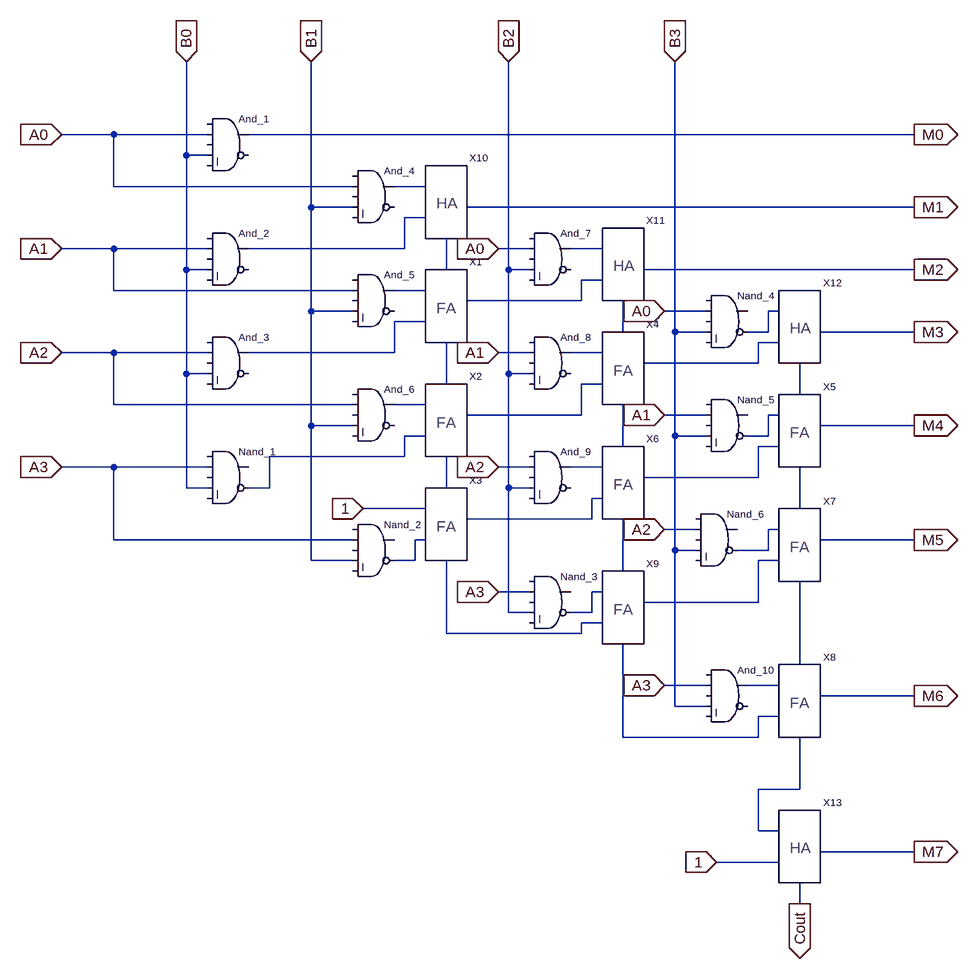
[diagram p0: schematic Bough_Wooley_Multiplier.asc]
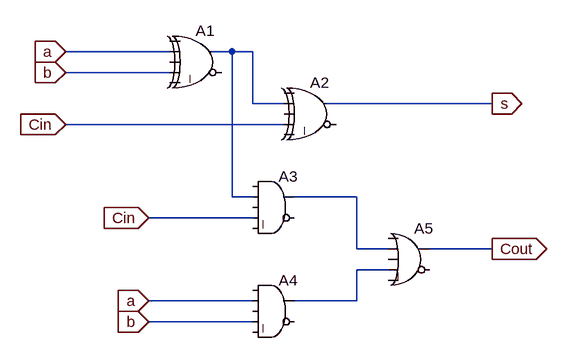
[diagram p1: sub-circuit full_adder_vertical.asc]
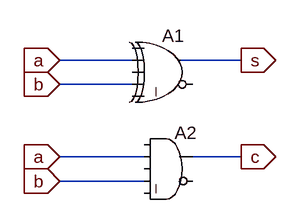
[diagram p2: sub-circuit half_adder.asc]
Bough_Wooley_Multiplier.asc, the LTspice schematic file:
Version 4
SHEET 1 3160 1104
WIRE 544 -336 464 -336
WIRE 688 -336 544 -336
WIRE 1776 -336 752 -336
WIRE 656 -304 656 -448
WIRE 688 -304 656 -304
WIRE 544 -256 544 -336
WIRE 912 -256 544 -256
WIRE 1024 -256 976 -256
WIRE 848 -224 848 -448
WIRE 912 -224 848 -224
WIRE 1776 -224 1088 -224
WIRE 1024 -208 992 -208
WIRE 544 -160 464 -160
WIRE 688 -160 544 -160
WIRE 992 -160 992 -208
WIRE 992 -160 752 -160
WIRE 1184 -160 1136 -160
WIRE 1296 -160 1248 -160
WIRE 656 -128 656 -304
WIRE 688 -128 656 -128
WIRE 1056 -128 1056 -176
WIRE 1152 -128 1152 -448
WIRE 1184 -128 1152 -128
WIRE 1776 -128 1360 -128
WIRE 1296 -112 1264 -112
WIRE 544 -96 544 -160
WIRE 912 -96 544 -96
WIRE 1024 -96 976 -96
WIRE 1264 -80 1264 -112
WIRE 1264 -80 1088 -80
WIRE 848 -64 848 -224
WIRE 912 -64 848 -64
WIRE 1456 -64 1392 -64
WIRE 1568 -64 1552 -64
WIRE 1024 -48 976 -48
WIRE 1328 -32 1328 -80
WIRE 1408 -32 1408 -448
WIRE 1456 -32 1408 -32
WIRE 1552 -32 1552 -64
WIRE 1552 -32 1520 -32
WIRE 1776 -32 1632 -32
WIRE 1568 -16 1536 -16
WIRE 544 0 464 0
WIRE 688 0 544 0
WIRE 976 0 976 -48
WIRE 976 0 752 0
WIRE 1184 0 1136 0
WIRE 1296 0 1248 0
WIRE 1536 16 1536 -16
WIRE 1536 16 1360 16
WIRE 656 32 656 -128
WIRE 688 32 656 32
WIRE 1152 32 1152 -128
WIRE 1184 32 1152 32
WIRE 1056 48 1056 -16
WIRE 1296 48 1264 48
WIRE 1600 64 1600 16
WIRE 544 80 544 0
WIRE 912 80 544 80
WIRE 1024 80 976 80
WIRE 1264 96 1264 48
WIRE 1264 96 1088 96
WIRE 1456 96 1392 96
WIRE 1568 96 1552 96
WIRE 848 112 848 -64
WIRE 912 112 848 112
WIRE 1776 112 1632 112
WIRE 1024 128 992 128
WIRE 1408 128 1408 -32
WIRE 1456 128 1408 128
WIRE 1552 128 1552 96
WIRE 1552 128 1520 128
WIRE 1328 144 1328 80
WIRE 1568 144 1536 144
WIRE 992 160 992 128
WIRE 992 160 784 160
WIRE 544 176 464 176
WIRE 688 176 544 176
WIRE 1184 176 1136 176
WIRE 1296 176 1248 176
WIRE 1536 192 1536 144
WIRE 1536 192 1360 192
WIRE 656 208 656 32
WIRE 688 208 656 208
WIRE 784 208 784 160
WIRE 784 208 752 208
WIRE 1056 208 1056 160
WIRE 1152 208 1152 32
WIRE 1184 208 1152 208
WIRE 1296 224 1280 224
WIRE 1024 240 928 240
WIRE 1600 240 1600 176
WIRE 1280 256 1280 224
WIRE 1280 256 1088 256
WIRE 1440 272 1392 272
WIRE 1568 272 1552 272
WIRE 544 288 544 176
WIRE 912 288 544 288
WIRE 1024 288 1008 288
WIRE 1776 288 1632 288
WIRE 1408 304 1408 128
WIRE 1440 304 1408 304
WIRE 1552 304 1552 272
WIRE 1552 304 1504 304
WIRE 848 320 848 112
WIRE 912 320 848 320
WIRE 1008 320 1008 288
WIRE 1008 320 976 320
WIRE 1568 320 1536 320
WIRE 1328 336 1328 256
WIRE 1184 368 1136 368
WIRE 1296 368 1280 368
WIRE 1536 384 1536 320
WIRE 1536 384 1360 384
WIRE 1152 400 1152 208
WIRE 1184 400 1152 400
WIRE 1280 400 1280 368
WIRE 1280 400 1248 400
WIRE 1296 416 1264 416
WIRE 1056 432 1056 320
WIRE 1264 432 1264 416
WIRE 1264 432 1056 432
WIRE 1600 480 1600 352
WIRE 1456 512 1392 512
WIRE 1568 512 1520 512
WIRE 1776 528 1632 528
WIRE 1408 544 1408 304
WIRE 1456 544 1408 544
WIRE 1568 560 1536 560
WIRE 1328 592 1328 448
WIRE 1536 592 1536 560
WIRE 1536 592 1328 592
WIRE 1600 672 1600 592
WIRE 1600 672 1536 672
WIRE 1536 736 1536 672
WIRE 1568 736 1536 736
WIRE 1776 768 1632 768
WIRE 1568 784 1472 784
WIRE 1600 848 1600 816
FLAG 464 -336 A0
IOPIN 464 -336 In
FLAG 464 -160 A1
IOPIN 464 -160 In
FLAG 464 0 A2
IOPIN 464 0 In
FLAG 464 176 A3
IOPIN 464 176 In
FLAG 1136 -160 A0
IOPIN 1136 -160 In
FLAG 1136 0 A1
IOPIN 1136 0 In
FLAG 1136 176 A2
IOPIN 1136 176 In
FLAG 1136 368 A3
IOPIN 1136 368 In
FLAG 1392 -64 A0
IOPIN 1392 -64 In
FLAG 1392 96 A1
IOPIN 1392 96 In
FLAG 1392 272 A2
IOPIN 1392 272 In
FLAG 1392 512 A3
IOPIN 1392 512 In
FLAG 1408 -448 B3
IOPIN 1408 -448 In
FLAG 1152 -448 B2
IOPIN 1152 -448 In
FLAG 848 -448 B1
IOPIN 848 -448 In
FLAG 656 -448 B0
IOPIN 656 -448 In
FLAG 1776 -336 M0
IOPIN 1776 -336 Out
FLAG 1776 -224 M1
IOPIN 1776 -224 Out
FLAG 1776 -128 M2
IOPIN 1776 -128 Out
FLAG 1776 -32 M3
IOPIN 1776 -32 Out
FLAG 1776 112 M4
IOPIN 1776 112 Out
FLAG 1776 288 M5
IOPIN 1776 288 Out
FLAG 1776 528 M6
IOPIN 1776 528 Out
FLAG 1776 768 M7
IOPIN 1776 768 Out
FLAG 928 240 1
IOPIN 928 240 In
FLAG 1472 784 1
IOPIN 1472 784 In
FLAG 1600 848 Cout
IOPIN 1600 848 Out
SYMBOL Digital\\and 720 -384 R0
WINDOW 0 16 24 Left 1
SYMATTR InstName And_1
SYMBOL Digital\\and 720 -208 R0
WINDOW 0 16 24 Left 1
SYMATTR InstName And_2
SYMBOL Digital\\and 720 -48 R0
WINDOW 0 16 24 Left 1
SYMATTR InstName And_3
SYMBOL Digital\\and 720 128 R0
WINDOW 0 16 24 Left 1
SYMATTR InstName Nand_1
SYMBOL Digital\\and 944 -304 R0
WINDOW 0 16 24 Left 1
SYMATTR InstName And_4
SYMBOL Digital\\and 944 -144 R0
WINDOW 0 16 24 Left 1
SYMATTR InstName And_5
SYMBOL Digital\\and 944 32 R0
WINDOW 0 16 24 Left 1
SYMATTR InstName And_6
SYMBOL Digital\\and 944 240 R0
WINDOW 0 16 24 Left 1
SYMATTR InstName Nand_2
SYMBOL Digital\\and 1216 -208 R0
WINDOW 0 16 24 Left 1
SYMATTR InstName And_7
SYMBOL Digital\\and 1216 -48 R0
WINDOW 0 16 24 Left 1
SYMATTR InstName And_8
SYMBOL Digital\\and 1216 128 R0
WINDOW 0 16 24 Left 1
SYMATTR InstName And_9
SYMBOL Digital\\and 1216 320 R0
WINDOW 0 16 24 Left 1
SYMATTR InstName Nand_3
SYMBOL Digital\\and 1488 -112 R0
WINDOW 0 16 24 Left 1
SYMATTR InstName Nand_4
SYMBOL Digital\\and 1488 48 R0
WINDOW 0 16 24 Left 1
SYMATTR InstName Nand_5
SYMBOL Digital\\and 1472 224 R0
WINDOW 0 16 24 Left 1
SYMATTR InstName Nand_6
SYMBOL Digital\\and 1488 464 R0
WINDOW 0 16 24 Left 1
SYMATTR InstName And_10
SYMBOL Full_Adder_Vertical 1088 -80 R0
SYMATTR InstName X1
SYMBOL Full_Adder_Vertical 1088 96 R0
SYMATTR InstName X2
SYMBOL Full_Adder_Vertical 1088 256 R0
SYMATTR InstName X3
SYMBOL Full_Adder_Vertical 1360 16 R0
SYMATTR InstName X4
SYMBOL Full_Adder_Vertical 1632 112 R0
SYMATTR InstName X5
SYMBOL Full_Adder_Vertical 1360 192 R0
SYMATTR InstName X6
SYMBOL Full_Adder_Vertical 1632 288 R0
SYMATTR InstName X7
SYMBOL Full_Adder_Vertical 1632 528 R0
SYMATTR InstName X8
SYMBOL Full_Adder_Vertical 1360 384 R0
SYMATTR InstName X9
SYMBOL Half_Adder 1072 -208 R0
SYMATTR InstName X10
SYMBOL Half_Adder 1344 -112 R0
SYMATTR InstName X11
SYMBOL Half_Adder 1616 -16 R0
SYMATTR InstName X12
SYMBOL Half_Adder 1616 784 R0
SYMATTR InstName X13

full_adder_vertical.asc, the sub-circuit schematic file:
Version 4
SHEET 1 880 680
WIRE 48 48 -112 48
WIRE 144 48 112 48
WIRE 176 48 144 48
WIRE 48 80 -112 80
WIRE 176 128 176 48
WIRE 224 128 176 128
WIRE 544 128 288 128
WIRE 224 160 -112 160
WIRE 144 272 144 48
WIRE 176 272 144 272
WIRE 336 272 240 272
WIRE 176 304 16 304
WIRE 336 352 336 272
WIRE 384 352 336 352
WIRE 544 352 448 352
WIRE 384 384 336 384
WIRE 176 432 16 432
WIRE 336 432 336 384
WIRE 336 432 240 432
WIRE 176 464 16 464
FLAG -112 48 a
IOPIN -112 48 In
FLAG -112 80 b
IOPIN -112 80 In
FLAG -112 160 Cin
IOPIN -112 160 In
FLAG 16 304 Cin
IOPIN 16 304 In
FLAG 16 432 a
IOPIN 16 432 In
FLAG 16 464 b
IOPIN 16 464 In
FLAG 544 128 s
IOPIN 544 128 Out
FLAG 544 352 Cout
IOPIN 544 352 Out
SYMBOL Digital\\xor 96 0 R0
SYMATTR InstName A1
SYMBOL Digital\\xor 272 80 R0
SYMATTR InstName A2
SYMBOL Digital\\and 208 224 R0
SYMATTR InstName A3
SYMBOL Digital\\and 208 384 R0
SYMATTR InstName A4
SYMBOL Digital\\or 416 304 R0
SYMATTR InstName A5

half_adder.asc, the sub-circuit schematic file:
Version 4
SHEET 1 880 680
WIRE 128 96 32 96
WIRE 272 96 192 96
WIRE 128 128 32 128
WIRE 144 224 32 224
WIRE 272 224 208 224
WIRE 144 256 32 256
FLAG 32 96 a
IOPIN 32 96 In
FLAG 32 128 b
IOPIN 32 128 In
FLAG 32 224 a
IOPIN 32 224 In
FLAG 32 256 b
IOPIN 32 256 In
FLAG 272 224 c
IOPIN 272 224 Out
FLAG 272 96 s
IOPIN 272 96 Out
SYMBOL Digital\\xor 176 48 R0
SYMATTR InstName A1
SYMBOL Digital\\and 176 176 R0
SYMATTR InstName A2

The netlist it stands for:
* Bough_Wooley_Multiplier.asc
And_1 0 A0 0 B0 0 0 M0 0 AND
And_2 0 A1 0 B0 0 0 N002 0 AND
And_3 0 A2 0 B0 0 0 N008 0 AND
A§Nand_1 0 A3 0 B0 0 N017 0 0 AND
And_4 0 A0 0 B1 0 0 N001 0 AND
And_5 0 A1 0 B1 0 0 N006 0 AND
And_6 0 A2 0 B1 0 0 N015 0 AND
A§Nand_2 0 A3 0 B1 0 N025 0 0 AND
And_7 0 A0 0 B2 0 0 N003 0 AND
And_8 0 A1 0 B2 0 0 N011 0 AND
And_9 0 A2 0 B2 0 0 N020 0 AND
A§Nand_3 0 A3 0 B2 0 N028 0 0 AND
A§Nand_4 0 A0 0 B3 0 N007 0 0 AND
A§Nand_5 0 A1 0 B3 0 N016 0 0 AND
A§Nand_6 0 A2 0 B3 0 N024 0 0 AND
And_10 0 A3 0 B3 0 0 N031 0 AND
XX1 N008 N006 N004 N012 N005 full_adder_vertical
XX2 N017 N015 N012 N021 N013 full_adder_vertical
XX3 N025 1 N021 N029 N022 full_adder_vertical
XX4 N013 N011 N009 N018 N010 full_adder_vertical
XX5 N019 N016 N014 N023 M4 full_adder_vertical
XX6 N022 N020 N018 N027 N019 full_adder_vertical
XX7 N026 N024 N023 N030 M5 full_adder_vertical
XX8 N032 N031 N030 N033 M6 full_adder_vertical
XX9 N029 N028 N027 N032 N026 full_adder_vertical
XX10 N002 N001 N004 M1 half_adder
XX11 N005 N003 N009 M2 half_adder
XX12 N010 N007 N014 M3 half_adder
XX13 1 N033 Cout M7 half_adder

* block symbol definitions
.subckt full_adder_vertical a b Cin Cout s
A1 0 a 0 b 0 0 N001 0 XOR
A2 0 N001 0 Cin 0 0 s 0 XOR
A3 0 N001 0 Cin 0 0 N002 0 AND
A4 0 a 0 b 0 0 N003 0 AND
A5 0 N002 0 N003 0 0 Cout 0 OR
.ends full_adder_vertical

.subckt half_adder a b c s
A1 0 a 0 b 0 0 s 0 XOR
A2 0 a 0 b 0 0 c 0 AND
.ends half_adder

.backanno
.end